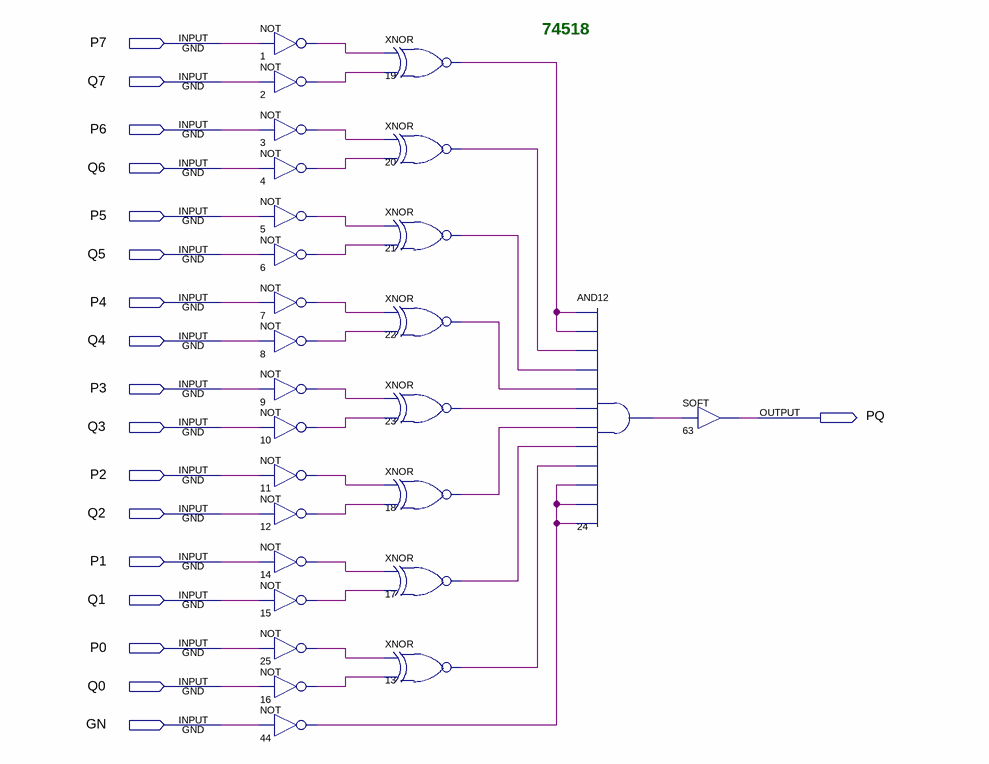
[diagram p0: schematic sheet]
// Quartus schematic p74518.bdf as structural Verilog: 27 symbols, 18 pins
module p74518 (
  input  P7,
  input  Q7,
  input  P6,
  input  Q6,
  input  P5,
  input  Q5,
  input  P4,
  input  Q4,
  input  P3,
  input  Q3,
  input  P2,
  input  Q2,
  input  P1,
  input  Q1,
  input  P0,
  input  Q0,
  input  GN,
  output PQ
);

  wire n1_out, n2_out, n3_out, n4_out, n5_out, n6_out, n7_out, n8_out, n9_out, n10_out, n11_out, n12_out,
       n13_out, n14_out, n15_out, n16_out, n17_out, n18_out, n19_out, n20_out, n21_out, n22_out, n23_out,
       n24_out, n25_out, n44_out;

  not u_1 (n1_out, P7);
  not u_2 (n2_out, Q7);
  not u_3 (n3_out, P6);
  not u_4 (n4_out, Q6);
  not u_5 (n5_out, P5);
  not u_6 (n6_out, Q5);
  not u_7 (n7_out, P4);
  not u_8 (n8_out, Q4);
  not u_9 (n9_out, P3);
  not u_10 (n10_out, Q3);
  not u_11 (n11_out, P2);
  not u_12 (n12_out, Q2);
  not u_14 (n14_out, P1);
  not u_15 (n15_out, Q1);
  not u_25 (n25_out, P0);
  not u_16 (n16_out, Q0);
  not u_44 (n44_out, GN);
  xnor u_19 (n19_out, n1_out, n2_out);
  xnor u_20 (n20_out, n3_out, n4_out);
  xnor u_21 (n21_out, n5_out, n6_out);
  xnor u_22 (n22_out, n7_out, n8_out);
  xnor u_23 (n23_out, n9_out, n10_out);
  xnor u_18 (n18_out, n11_out, n12_out);
  xnor u_17 (n17_out, n14_out, n15_out);
  xnor u_13 (n13_out, n25_out, n16_out);
  and u_24 (n24_out, n19_out, n19_out, n20_out, n21_out, n22_out, n23_out, n18_out, n17_out, n13_out, n44_out, n44_out, n44_out);
  SOFT u_63 (.IN(n24_out), .OUT(PQ));

  // Notes on the sheet:
  //   74518
endmodule
